# EAGLE design sub1ghz (EAGLE 6.6.0)
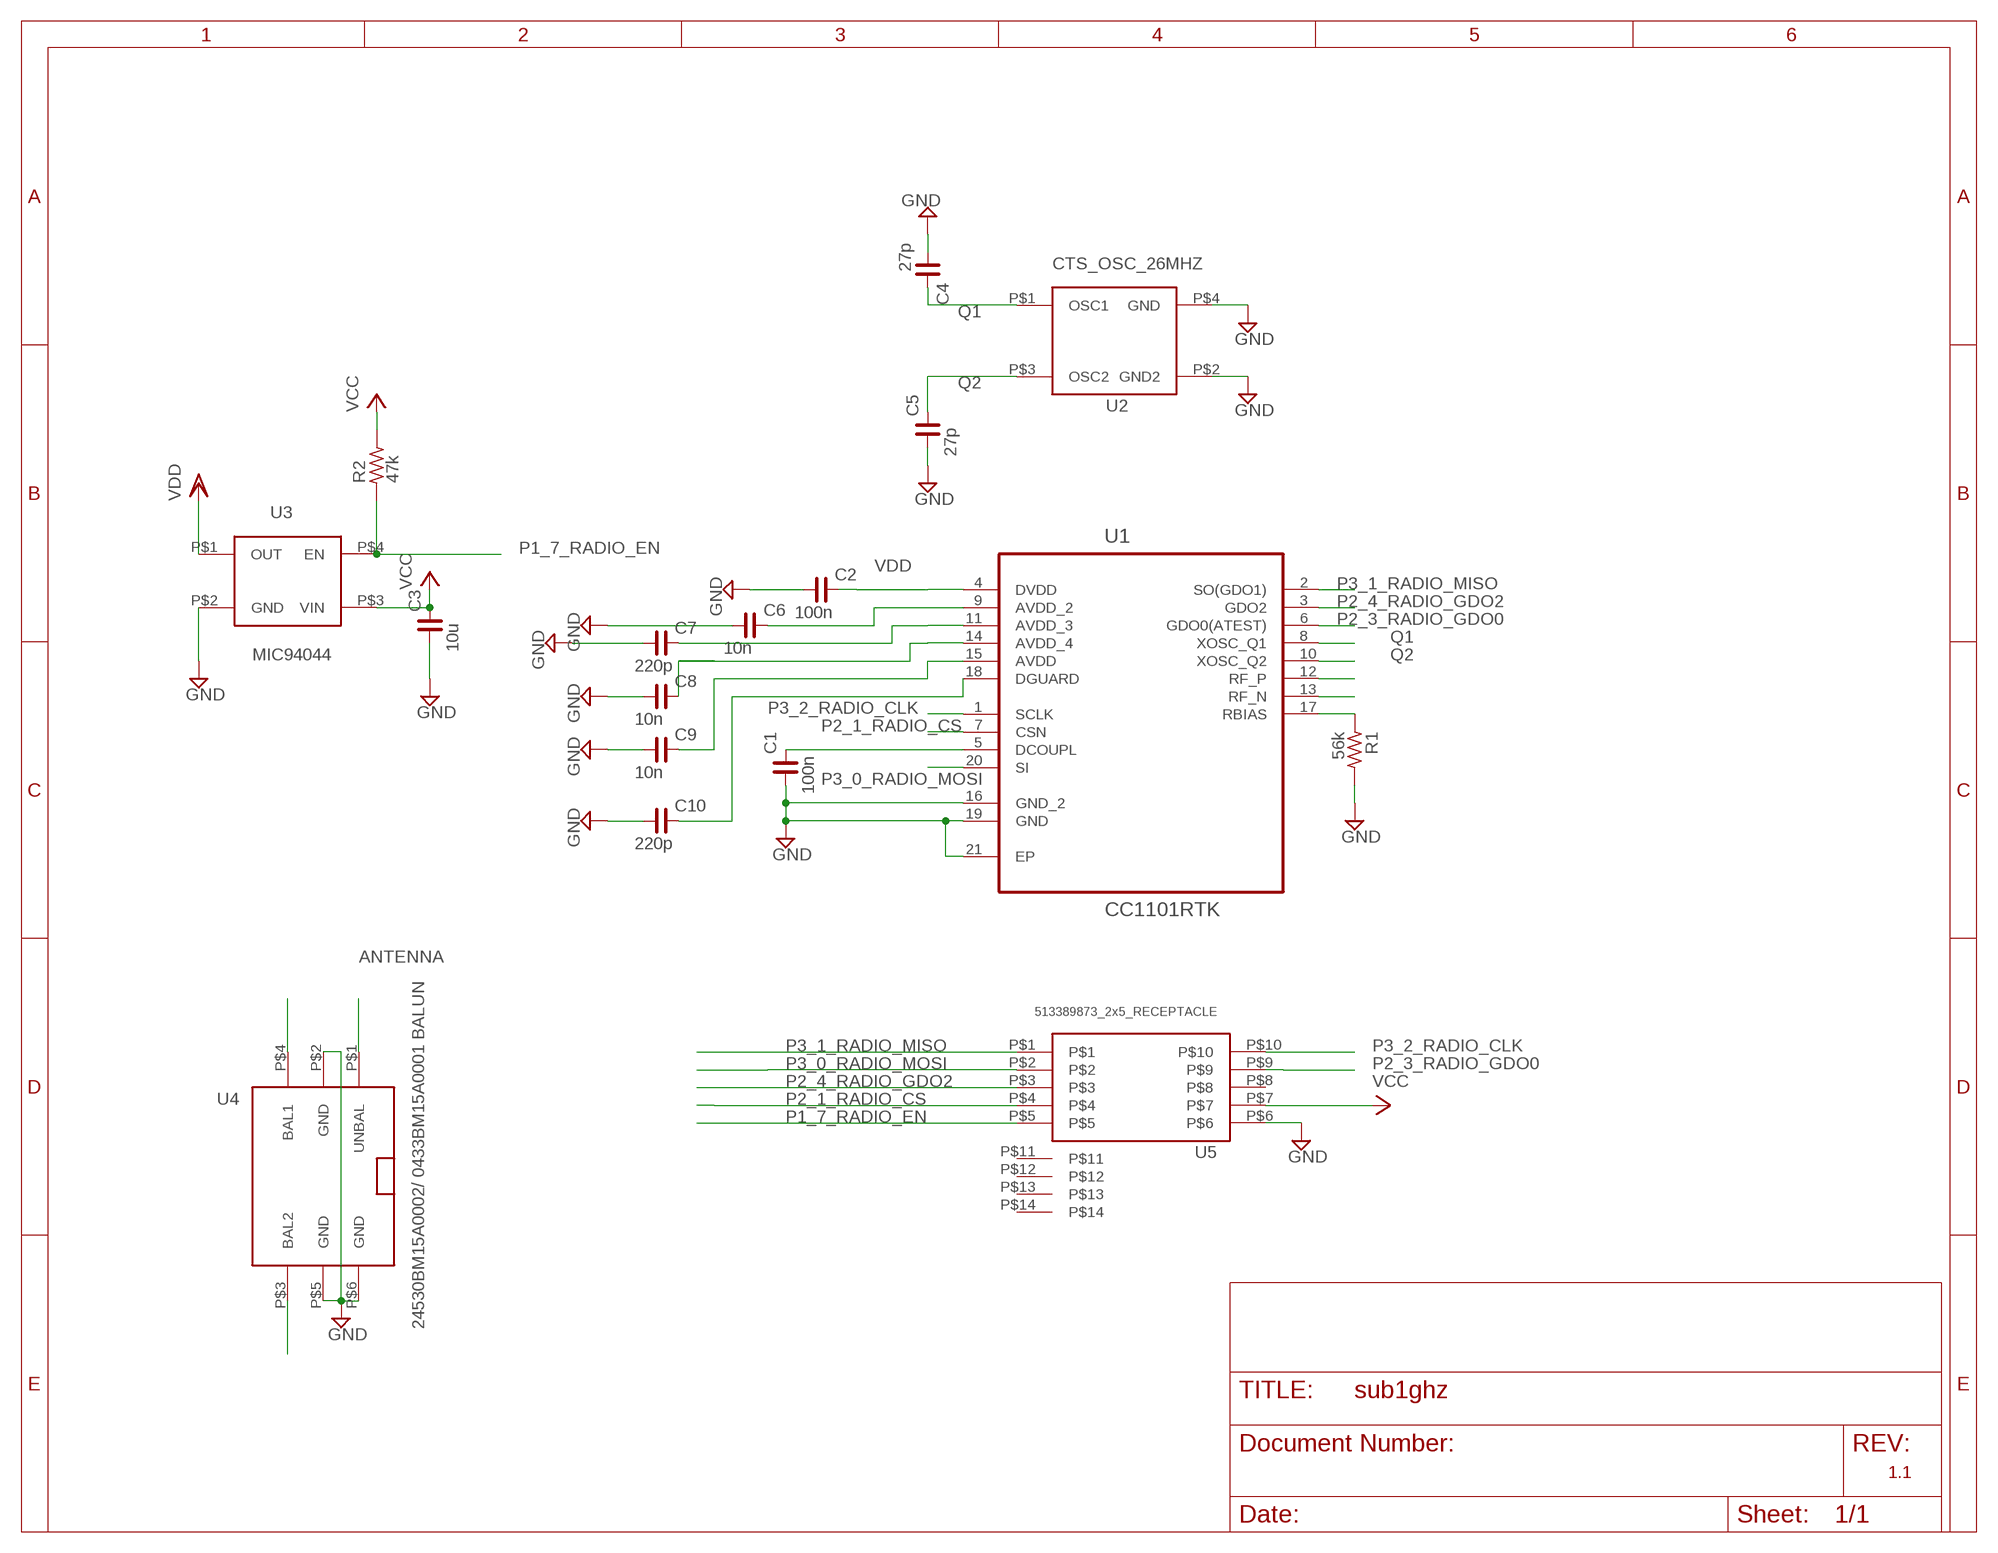
[diagram p0: schematic, sheet 1]

## Parts
C1  100n  C_0402  [C0402]
C2  100n  C_0402  [C0402]
C3  10u  C_0402  [C0402]
C4  27p  C_0402  [C0402]
C5  27p  C_0402  [C0402]
C6  10n  C_0402  [C0402]
C7  220p  C_0402  [C0402]
C8  10n  C_0402  [C0402]
C9  10n  C_0402  [C0402]
C10  220p  C_0402  [C0402]
R1  56k  R_0402  [R0402]
R2  47k  R_0402  [R0402]
U1  CC1101RTK  [QFN50P400X400X90-21N]
U$1  26_MHZ_OSC  [CTS_26_PACKAGE]
U$2  MIC94044  [MIC94045YFL_FOOTPRINT]
U$3  24530BM15A0002  [24530BM15A0002]
U$4  513389873_2X5_RECEPTACLE  [513389873_2X5_RECEPTACLE]

## Nets
ANTENNA: U$3.P$1(UNBAL)
GND: C1.1 C2.1 C3.1 C4.1 C5.1 C6.1 C7.1 C8.1 C9.1 C10.1 R1.2 U1.16(GND_2) U1.19(GND) U1.21(EP) U$1.P$2(GND2) U$1.P$4(GND) U$2.P$2(GND) U$3.P$2(GND) U$3.P$5(GND) U$3.P$6(GND) U$4.P$6
N$1: U1.12(RF_P) U$3.P$4(BAL1)
N$2: U1.13(RF_N) U$3.P$3(BAL2)
N$5: R1.1 U1.17(RBIAS)
N$7: C1.2 U1.5(DCOUPL)
P1_7_RADIO_EN: R2.1 U$2.P$4(EN) U$4.P$5
P2_1_RADIO_CS: U1.7(CSN) U$4.P$4
P2_3_RADIO_GDO0: U1.6(GDO0(ATEST)) U$4.P$9
P2_4_RADIO_GDO2: U1.3(GDO2) U$4.P$3
P3_0_RADIO_MOSI: U1.20(SI) U$4.P$2
P3_1_RADIO_MISO: U1.2(SO(GDO1)) U$4.P$1
P3_2_RADIO_CLK: U1.1(SCLK) U$4.P$10
Q1: C4.2 U1.8(XOSC_Q1) U$1.P$1(OSC1)
Q2: C5.2 U1.10(XOSC_Q2) U$1.P$3(OSC2)
VCC: C3.2 R2.2 U$2.P$3(VIN) U$4.P$7
VDD: C2.2 C6.2 C7.2 C8.2 C9.2 C10.2 U1.4(DVDD) U1.9(AVDD_2) U1.11(AVDD_3) U1.14(AVDD_4) U1.15(AVDD) U1.18(DGUARD) U$2.P$1(OUT)
Unconnected: U$4.P$8 U$4.P$11 U$4.P$12 U$4.P$13 U$4.P$14

## Notes on the sheet
- U2
- U3
- U4
- U5
- 1.1

## Library data of the parts
C1-C10 = rc-master-smd:C_: NON-POLARIZED CAP
R1 R2 = rc-master-smd:R_: RESISTOR
U1 = cc1101:CC1101RTK: Low-Power Sub-1 GHz RF Transceiver; MPN: CC1101RTK; OC_FARNELL: 1555264; OC_NEWARK: 50M8833; PACKAGE: QFN-20; SUPPLIER: Texas Instruments
U$1 = CTS_OSC:26_MHZ_OSC
U$2 = MIC94045YFL:MIC94044
U$3 = 24530BM15A0002:24530BM15A0002
U$4 = Molex_SlimStack:513389873_2X5_RECEPTACLE

## Board
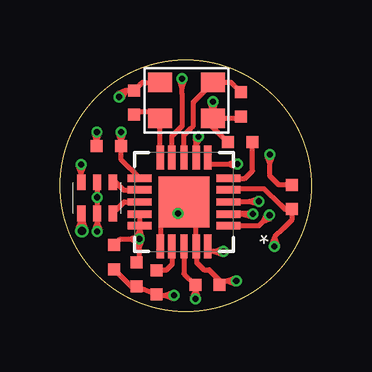
[diagram p1: board, top side]
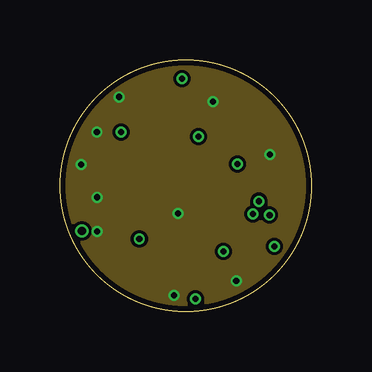
[diagram p2: board, inner layer Route2]
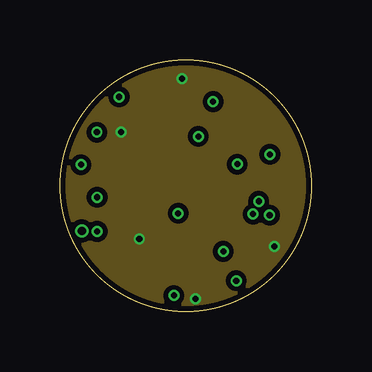
[diagram p3: board, inner layer Route15]
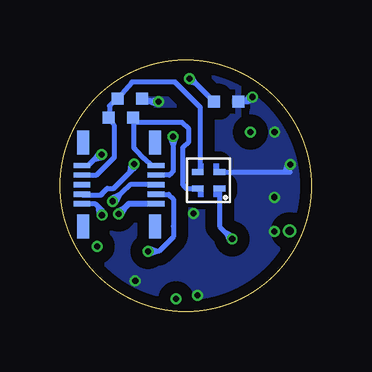
[diagram p4: board, bottom side, seen from below]

Size 10.5 x 10.5 mm. Coordinates in mm from the lower left corner, seen from the top.
Outline: circle at 5.25,5.25 radius 5.25
Copper layers (1+2*15+16): Top 0.0356mm / dielectric 0.1702mm / Route2 0.0178mm / dielectric 47mil / Route15 0.0178mm / dielectric 0.1702mm / Bottom 0.0356mm
Design rules "LaenPCBOrder - 4 layers": minimum track width 5mil, minimum drill 10mil, track to track 5mil, track to pad 5mil, pad to pad 5mil, via to via 5mil, smd to smd 5mil, copper to edge 10mil, drill to drill 5mil, minimum pad ring 4mil, minimum via ring 4mil, stop-mask expansion 3mil, vias tented up to drill 4.5mil, thermal gap 10mil

### Footprints (pad centres in the part's own frame; a part is rotated, then mirrored left to right if it is on the bottom)
C0402 = smd 0.5 x 0.5: 1 -0.508,0; 2 0.508,0
R0402 = smd 0.5 x 0.5: 1 -0.508,0; 2 0.508,0
QFN50P400X400X90-21N = smd 1.016 x 0.305: 1 -1.854,0.991; 2 -1.854,0.508; 3 -1.854,0; 4 -1.854,-0.508; 5 -1.854,-0.991; 11 1.854,-0.991; 12 1.854,-0.508; 13 1.854,0; 14 1.854,0.508; 15 1.854,0.991 | smd 0.305 x 1.016: 6 -0.991,-1.854; 7 -0.508,-1.854; 8 0,-1.854; 9 0.508,-1.854; 10 0.991,-1.854; 16 0.991,1.854; 17 0.508,1.854; 18 0,1.854; 19 -0.508,1.854; 20 -0.991,1.854 | smd 2.12 x 2.12: 21 0,0
CTS_26_PACKAGE = smd 1 x 0.8: P$1 -1.1,-0.75; P$2 1.1,-0.75; P$3 1.1,0.75; P$4 -1.1,0.75
MIC94045YFL_FOOTPRINT = smd 0.26 x 0.49: P$1 -0.341,-0.453; P$2 0.342,-0.454; P$3 0.342,0.457; P$4 -0.34,0.454
24530BM15A0002 = smd 0.65 x 0.35: P$1 -0.65,0.65; P$2 -0.65,0; P$3 -0.65,-0.65; P$4 0.65,-0.65; P$5 0.65,0; P$6 0.65,0.65
513389873_2X5_RECEPTACLE = smd 0.7 x 0.22: P$1 -1.55,0.8; P$2 -1.55,0.4; P$3 -1.55,0; P$4 -1.55,-0.4; P$5 -1.55,-0.8; P$6 1.55,-0.8; P$7 1.55,-0.4; P$8 1.55,0; P$9 1.55,0.4; P$10 1.55,0.8 | smd 0.5 x 1: P$11 -1.5,1.75; P$12 1.5,1.75; P$13 -1.5,-1.75; P$14 1.5,-1.75

### Placement (x,y rotation side)
C1  7.53,7.07 0 top
C2  9.67,4.78 270 top
C3  7.59,8.88 180 bottom
C4  7.54,8.64 90 top
C5  3.09,8.72 270 top
C6  3.57,8.75 180 bottom
C7  2.05,6.9 0 top
C8  2.26,2.26 90 top
C9  3.2,1.55 90 top
C10  6.16,1.11 180 top
R1  4.03,1.22 270 top
R2  7.96,8.1 180 bottom
U1  5.17,4.58 180 top
U$1  5.28,8.81 180 top
U$2  4.3,5.48 90 bottom
U$3  1.55,4.74 90 top
U$4  8.04,5.29 180 bottom

### Tracks (layer width: path | path; a pad name or v marks a point on that pad's centre or on a via)
ANTENNA  (via drill 0.35)
  Top 0.2: U$3.P$1 v0.91,3.37 | v0.91,3.37 0.75,3.42 0.91,3.89 1.08,3.42 v0.91,3.37
GND  (via drill 0.25)
  Top 0.2: U$1.P$2 3.43,9.56 C5.1 2.74,9.23 | 2.74,9.23 v2.47,8.96 | U1.16 4.22,2.75 4.22,3.76 5.04,4.58 U1.21 5.68,4.07 U1.19 5.7,2.7 5.7,2.05 6.01,1.75 6.23,1.75 6.66,1.31 C10.1 6.71,1.15 6.71,1.28 v7.36,1.28 | 7.04,8.06 6.97,8.06 | v6.39,8.76 6.39,8.07 U$1.P$4 6.38,7.67 6.99,7.07 C1.1 | C2.1 | C2.1 9.13,5.29 8.76,5.66 v8.76,6.55 | C7.1 v1.54,7.49 | v4.75,0.67 4.07,0.67 R1.2 C9.1 2.98,1.04 C8.1 | U$3.P$2 | U$3.P$2 v1.55,3.34 | U$3.P$5 U$3.P$2 | U$3.P$6 0.88,5.41 v0.88,6.13 | 2.74,9.23 2.41,9.07 v2.47,8.96 | 2.74,9.23 2.58,8.9 v2.47,8.96 | v1.54,7.49 1.66,7.44 1.54,7.11 1.42,7.44 v1.54,7.49 | v0.88,6.13 1,6.09 0.88,5.75 0.76,6.09 v0.88,6.13 | v1.55,3.34 1.43,3.39 1.55,3.72 1.67,3.39 v1.55,3.34 | v6.39,8.76 6.51,8.72 6.39,8.38 6.27,8.71 v6.39,8.76 | v8.76,6.55 8.88,6.51 8.76,6.17 8.64,6.51 v8.76,6.55 | v4.75,0.67 4.71,0.55 4.37,0.67 4.71,0.79 v4.75,0.67 | v7.36,1.28 7.31,1.16 6.97,1.28 7.31,1.4 v7.36,1.28
  Top 0.203: C4.1 7.47,8.06 6.97,8.06 U$1.P$4
  Bottom 0.2: v8.76,6.55 8.86,6.55 9.1,6.31 9.32,6.09 U$4.P$6 | U$2.P$2 0.9,5.82 v0.88,6.13 | v0.88,6.13 1.01,6.17 1.1,5.82 0.81,6.03 v0.88,6.13 | v6.39,8.76 6.43,8.88 6.77,8.76 6.43,8.64 v6.39,8.76 | v8.76,6.55 8.86,6.63 9.07,6.34 8.73,6.43 v8.76,6.55 | C3.1 v6.39,8.76
  Bottom 0.203: C6.1 2.67,8.75 v2.47,8.96 | v2.47,8.96 2.57,9.03 2.79,8.75 2.44,8.83 v2.47,8.96
  other vias: 1.55,4.77 4.93,4.1
  pour Route2: 0,5.25 arc-90 5.25,10.5 arc-93 10.5,5.25 arc-87 5.25,0 arc-89
  pour Bottom (isolate 0.5): 0,5.25 arc-90 5.25,10.5 arc-93 10.5,5.25 arc-87 5.25,0 arc-89
N$1
  Top 0.2: U1.12 | U$3.P$4 2.25,5.47 2.65,5.08 U1.12
N$2
  Top 0.2: U$3.P$3 2.68,4.58 U1.13
N$5
  Top 0.2: U1.17 4.68,2.71 4.68,1.98 4.43,1.73 R1.1
N$7
  Top 0.2: U1.5 7.03,5.56 7.72,5.56 7.9,5.73 8.03,5.87 C1.2
P1_7_RADIO_EN
  Bottom 0.2: U$4.P$5 6.68,6.09 6.96,6.37 7.34,6.76 7.41,6.83 7.41,7.96 R2.1 7.39,7.89 5.4,7.89 5.12,7.62 5.12,7.08 5.38,6.82 5.38,5.29 5.36,5.27 5.22,5.14 U$2.P$4
P2_1_RADIO_CS  (via drill 0.25)
  Top 0.2: U1.7 5.68,7.19 v5.77,7.31 | v5.77,7.31 5.88,7.24 5.68,6.94 5.65,7.3 v5.77,7.31
  Bottom 0.2: U$4.P$4 5.95,5.69 5.91,5.73 5.76,5.88 5.76,7.27 v5.77,7.31 | v5.77,7.31 5.89,7.26 5.76,6.93 5.65,7.27 v5.77,7.31
  Bottom 0.203: U$4.P$4
P2_3_RADIO_GDO0  (via drill 0.25)
  Top 0.2: U1.6 6.18,6.41 6.18,6.16 v7.4,6.16 | v7.4,6.16 7.36,6.03 7.02,6.16 7.36,6.28 v7.4,6.16
  Bottom 0.2: U$4.P$9 9.57,4.87 8.76,4.87 8.76,4.9 8.52,5.14 8.25,5.14 7.74,5.65 7.4,5.99 v7.4,6.16 | v7.4,6.16 7.53,6.17 7.58,5.81 7.32,6.06 v7.4,6.16
P2_4_RADIO_GDO2  (via drill 0.25)
  Top 0.2: U1.3 7.05,4.56 7.09,4.6 v8.3,4.6 | v8.3,4.6 8.26,4.48 7.92,4.6 8.26,4.72 v8.3,4.6
  Bottom 0.2: U$4.P$3 7.56,5.29 v8.3,4.6 | v8.3,4.6 8.19,4.54 8.02,4.86 8.35,4.72 v8.3,4.6
P3_0_RADIO_MOSI  (via drill 0.25)
  Top 0.2: v6.82,2.51 6.17,2.51 U1.20 | v6.82,2.51 6.77,2.39 6.44,2.51 6.77,2.63 v6.82,2.51
  Bottom 0.2: U$4.P$2 5.96,4.89 5.76,4.69 5.76,3.57 5.76,3.12 U1.20 6.38,2.51 v6.82,2.51 | v6.82,2.51 6.77,2.39 6.44,2.51 6.77,2.63 v6.82,2.51
P3_1_RADIO_MISO  (via drill 0.25)
  Top 0.25: v8.06,4.07 U1.2 | v8.06,4.07 8.03,3.97 7.67,4.07 8.03,4.17 v8.06,4.07
  Bottom 0.25: U$4.P$1 7.63,4.49 v8.06,4.07 | v8.06,4.07 7.97,4.01 7.79,4.33 8.11,4.16 v8.06,4.07
P3_2_RADIO_CLK  (via drill 0.25)
  Top 0.2: U1.1 7.04,3.59 8.07,3.59 8.32,3.59 v8.75,4.02 | v8.75,4.02 8.8,3.91 8.48,3.75 8.63,4.08 v8.75,4.02
  Bottom 0.2: U$4.P$10 9.01,4.49 8.75,4.23 v8.75,4.02 | v8.75,4.02 8.65,4.11 8.9,4.37 8.88,4.02 v8.75,4.02
Q1
  Top 0.2: U$1.P$1 5.56,8.74 5.56,8.46 5.56,7.75 5.46,7.65 5.17,7.36 5.17,7.3
  Top 0.203: C4.2 7.14,9.56 U$1.P$1 | U1.8 5.17,7.3
Q2
  Top 0.203: U1.10 U$1.P$3 3.78,8.06 3.9,8.18 3.9,8.32 3.17,8.32 C5.2
VCC
  Bottom 0.2: U$4.P$7 8.96,5.7 8.36,6.3 8.22,6.44 8.22,7.21 8.22,7.76 R2.2 8.43,8.04 8.43,8.58 C3.2 7.5,9.58 6.32,9.58 5.69,9.58 4.64,8.52 4.64,8.21 4.64,5.93 U$2.P$3
VDD  (via drill 0.25)
  Top 0.2: C2.2 9.67,4.28 | U1.4 7.08,5.13 8.36,5.13 8.52,5.13 9.19,4.46 9.38,4.27 C2.2 | U1.11 2.55,6.33 C7.2 v2.55,7.49 | 4.67,6.58 4.67,7.31 5.02,7.66 5.04,7.69 5.11,7.76 5.11,9.06 5.1,9.07 v5.1,9.72 | v3.31,3.02 v3.32,3.03 U1.15 U1.14 | v3.31,3.02 3.31,2.17 C9.2 | U1.18 5.17,1.58 C10.2 5.65,0.58 v5.65,0.54 | C2.2 9.67,3.82 9.32,3.47 8.95,3.1 v8.95,2.71 | C8.2 2.52,3.02 v3.31,3.02 | v5.1,9.72 5.22,9.67 5.1,9.34 4.98,9.67 v5.1,9.72 | v2.55,7.49 2.67,7.45 2.55,7.11 2.43,7.45 v2.55,7.49 | v3.31,3.02 3.19,3.07 3.32,3.41 3.43,3.07 v3.31,3.02 | v3.31,3.02 3.43,2.98 3.31,2.64 3.19,2.98 v3.31,3.02 | v3.31,3.02 3.27,2.9 2.93,3.02 3.27,3.15 v3.31,3.02 | v5.65,0.54 5.53,0.58 5.65,0.92 5.77,0.58 v5.65,0.54 | v8.95,2.71 8.83,2.76 8.95,3.1 9.07,2.76 v8.95,2.71
  Top 0.203: U1.9 4.67,6.58
  Bottom 0.2: U$2.P$1 3.84,3.56 v3.31,3.02 | C6.2 5.04,9.72 v5.1,9.72 | v5.1,9.72 5.14,9.6 4.8,9.48 4.99,9.79 v5.1,9.72 | v3.31,3.02 3.26,3.14 3.58,3.29 3.43,2.97 v3.31,3.02
  Bottom 0.203: C6.2
  pour Route15 (isolate 0.2): 0,5.25 arc-90 5.25,10.5 arc-93 10.5,5.25 arc-87 5.25,0 arc-89